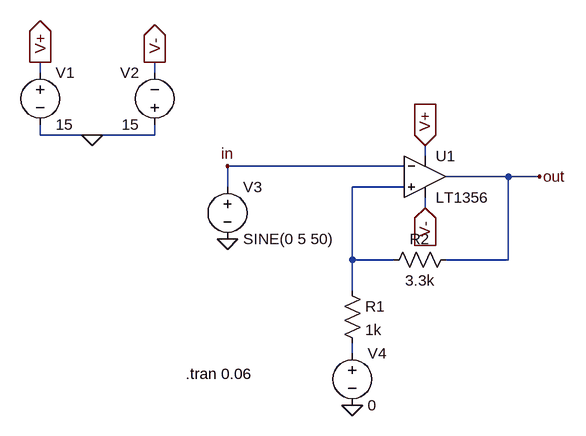
[diagram p0: schematic Hysteresis comparator.asc]
Hysteresis comparator.asc, the LTspice schematic file:
Version 4
SHEET 1 880 680
WIRE -272 -16 -272 -32
WIRE -96 -16 -96 -32
WIRE -272 80 -272 64
WIRE -192 80 -272 80
WIRE -96 80 -96 64
WIRE -96 80 -192 80
WIRE 320 112 320 96
WIRE 288 128 16 128
WIRE 448 144 352 144
WIRE 496 144 448 144
WIRE 16 160 16 128
WIRE 288 160 208 160
WIRE 320 192 320 176
WIRE 208 272 208 160
WIRE 272 272 208 272
WIRE 448 272 448 144
WIRE 448 272 352 272
WIRE 208 320 208 272
WIRE 208 416 208 400
FLAG -192 80 0
FLAG -272 -32 V+
IOPIN -272 -32 Out
FLAG -96 -32 V-
IOPIN -96 -32 Out
FLAG 320 96 V+
IOPIN 320 96 In
FLAG 320 192 V-
IOPIN 320 192 In
FLAG 16 240 0
FLAG 496 144 out
FLAG 16 128 in
FLAG 208 496 0
SYMBOL voltage -272 -32 R0
WINDOW 123 0 0 Left 0
WINDOW 39 0 0 Left 0
SYMATTR InstName V1
SYMATTR Value 15
SYMBOL voltage -96 80 R180
WINDOW 0 24 96 Left 2
WINDOW 3 24 16 Left 2
WINDOW 123 0 0 Left 0
WINDOW 39 0 0 Left 0
SYMATTR InstName V2
SYMATTR Value 15
SYMBOL OpAmps\\LT1356 320 80 R0
SYMATTR InstName U1
SYMBOL voltage 16 144 R0
WINDOW 123 0 0 Left 0
WINDOW 39 0 0 Left 0
SYMATTR InstName V3
SYMATTR Value SINE(0 5 50)
SYMBOL res 192 304 R0
SYMATTR InstName R1
SYMATTR Value 1k
SYMBOL res 368 256 R90
WINDOW 0 0 56 VBottom 2
WINDOW 3 32 56 VTop 2
SYMATTR InstName R2
SYMATTR Value 3.3k
SYMBOL voltage 208 400 R0
WINDOW 123 0 0 Left 0
WINDOW 39 0 0 Left 0
SYMATTR InstName V4
SYMATTR Value 0
TEXT -48 448 Left 2 !.tran 0.06

The netlist it stands for:
* Hysteresis comparator.asc
V1 V+ 0 15
V2 0 V- 15
XU1 N001 in V+ V- out LT1356  ; pins In+ In- V+ V- OUT
V3 in 0 SINE(0 5 50)
R1 N001 N002 1k
R2 out N001 3.3k
V4 N002 0 0
.tran 0.06
.backanno
.end

* Results of the author's LTspice run, read from the files saved beside the schematic
* Operating Point, zero values left out:
*   V(v+) = 15 V
*   V(v-) = -15 V
*   V(out) = 266 µV
*   I(R2) = 80.61 nA
*   I(R1) = 7.462 pA
*   I(V4) = 7.462 pA
*   I(V3) = -80.6 nA
*   I(V2) = -994.3 µA
*   I(V1) = -994.2 µA
*   Ix(u1:1) = 80.6 nA
*   Ix(u1:2) = 80.6 nA
*   Ix(u1:3) = 994.2 µA
*   Ix(u1:4) = -994.3 µA
*   Ix(u1:5) = -80.61 nA
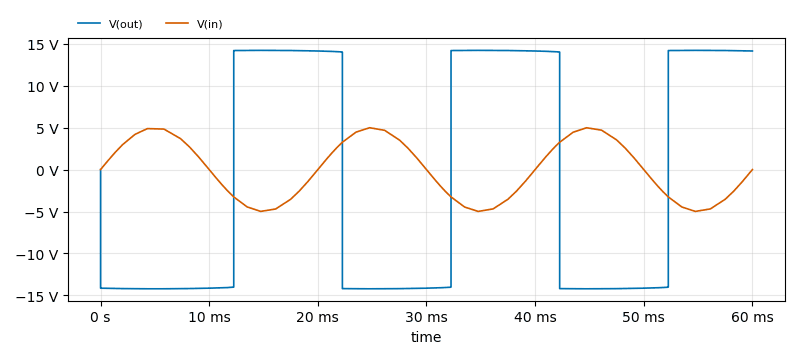
[diagram p1: Transient Analysis of Hysteresis comparator.asc, plotted from the saved traces]
* Transient Analysis, 1 run:
*   V(out): min -14.21 V, max 14.21 V, average -1.063 V, rms 14.17 V, last 14.13 V
*   V(in): min -4.986 V, max 4.987 V, average -853.6 µV, rms 3.507 V, last 0 V